# EAGLE schematic miranda_hector_115clock-6 (EAGLE 9.6.2)
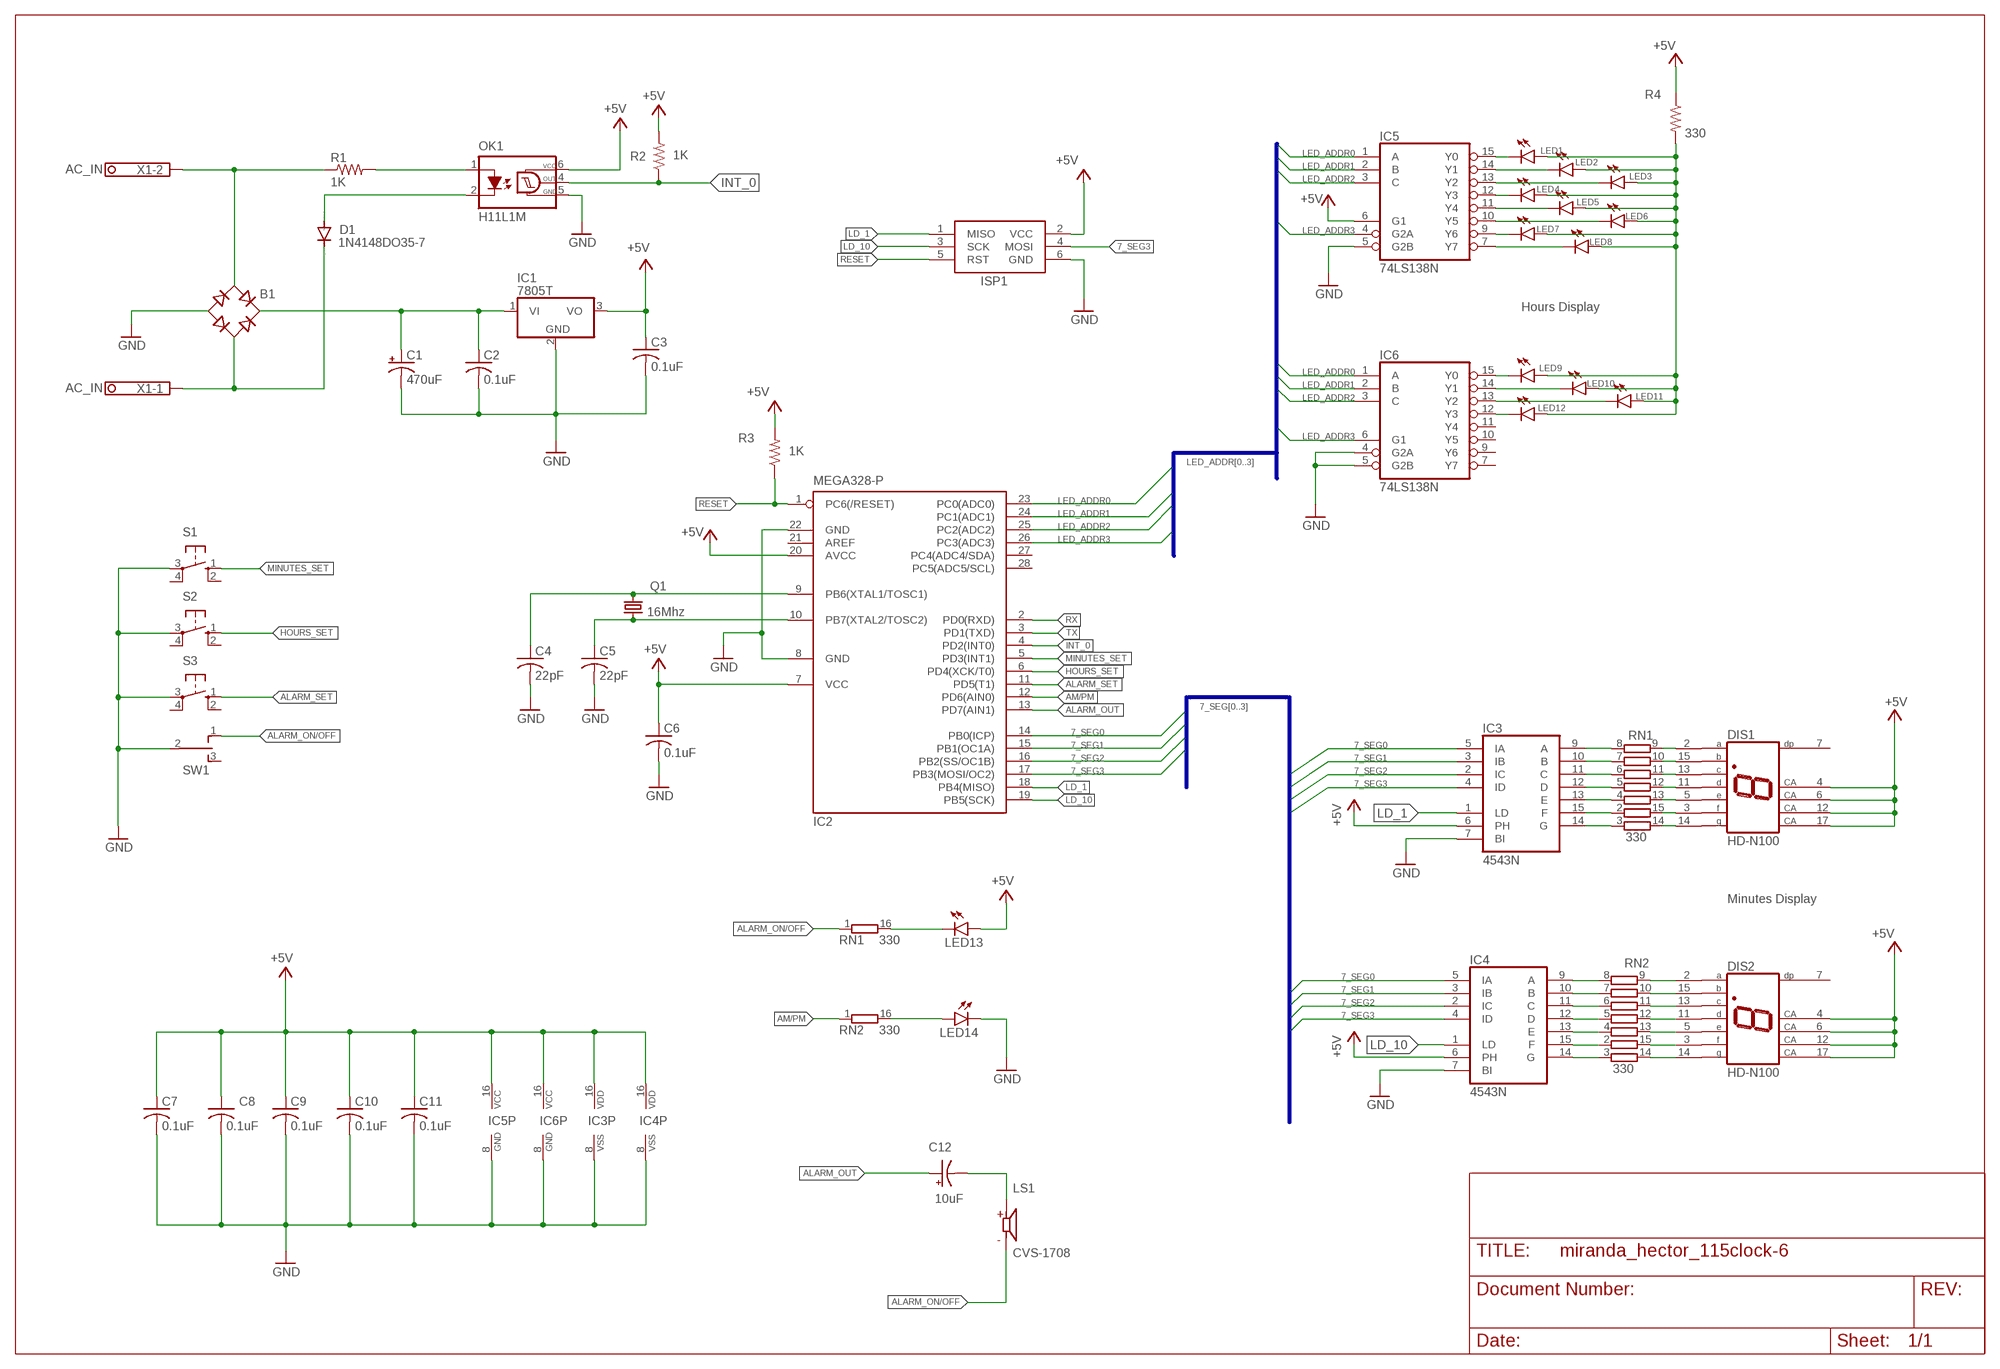
[diagram p0: schematic, sheet 1]

## Parts
B1  B-DIL  [B-DIL]
C1  470uF  CPOL-USE3.5-8  [E3,5-8]
C2  0.1uF  C-US025-025X050  [C025-025X050]
C3  0.1uF  C-US025-025X050  [C025-025X050]
C4  22pF  C-US025-025X050  [C025-025X050]
C5  22pF  C-US025-025X050  [C025-025X050]
C6  0.1uF  C-US025-025X050  [C025-025X050]
C7  0.1uF  C-US025-025X050  [C025-025X050]
C8  0.1uF  C-US025-025X050  [C025-025X050]
C9  0.1uF  C-US025-025X050  [C025-025X050]
C10  0.1uF  C-US025-025X050  [C025-025X050]
C11  0.1uF  C-US025-025X050  [C025-025X050]
C12  10uF  CPOL-USE2,5-6E  [E2,5-6E]
D1  1N4148DO35-7  [DO35-7]
DIS1  HD-N100  [HDSP-Q]
DIS2  HD-N100  [HDSP-Q]
IC1  7805T  [TO220H]
IC2  MEGA328-P  MEGA8-P  [DIL28-3]
IC3  4543N  [DIL16]
IC4  4543N  [DIL16]
IC5  74LS138N  [DIL16]
IC6  74LS138N  [DIL16]
ISP1  AVRISP-6  [AVRISP]
LED1  LED10MM  [LED10MM]
LED2  LED10MM  [LED10MM]
LED3  LED10MM  [LED10MM]
LED4  LED10MM  [LED10MM]
LED5  LED10MM  [LED10MM]
LED6  LED10MM  [LED10MM]
LED7  LED10MM  [LED10MM]
LED8  LED10MM  [LED10MM]
LED9  LED10MM  [LED10MM]
LED10  LED10MM  [LED10MM]
LED11  LED10MM  [LED10MM]
LED12  LED10MM  [LED10MM]
LED13  LED5MM  [LED5MM]
LED14  LED5MM  [LED5MM]
LS1  CVS-1708  [SPKR_CVS-1708]
OK1  H11L1M  [DIL06]
Q1  16Mhz  CRYSTALHC49S  [HC49/S]
R1  1K  R-US_0204/7  [0204/7]
R2  1K  R-US_0204/7  [0204/7]
R3  1K  R-US_0204/7  [0204/7]
R4  330  R-US_0204/7  [0204/7]
RN1  330  8R-P  [DIL16]
RN2  330  8R-P  [DIL16]
S1  10-XX  [B3F-10XX]
S2  10-XX  [B3F-10XX]
S3  10-XX  [B3F-10XX]
SW1  DIGICLOCK_S5  [FOOTPRINT_DIGICLOCK_S5]
X1  1751248  [1751248]

## Nets
7_SEG0: IC2.14(PB0(ICP)) IC3.5(IA) IC4.5(IA)
7_SEG1: IC2.15(PB1(OC1A)) IC3.3(IB) IC4.3(IB)
7_SEG2: IC2.16(PB2(SS/OC1B)) IC3.2(IC) IC4.2(IC)
7_SEG3: IC2.17(PB3(MOSI/OC2)) IC3.4(ID) IC4.4(ID) ISP1.4(MOSI)
+5V [Power]: C3.1 C6.1 C7.1 C8.1 C9.1 C10.1 C11.1 DIS1.4(CA) DIS1.6(CA) DIS1.12(CA) DIS1.17(CA) DIS2.4(CA) DIS2.6(CA) DIS2.12(CA) DIS2.17(CA) IC1.3(VO) IC2.7(VCC) IC2.20(AVCC) IC3.6(PH) IC3.16(VDD) IC4.6(PH) IC4.16(VDD) IC5.6(G1) IC5.16(VCC) IC6.16(VCC) ISP1.2(VCC) LED13.A OK1.6(VCC) R2.2 R3.2 R4.1
ALARM_ON/OFF: LS1.M RN1.1 SW1.1(O)
ALARM_OUT: C12.+ IC2.13(PD7(AIN1))
ALARM_SET: IC2.11(PD5(T1)) S3.1(S)
AM/PM: IC2.12(PD6(AIN0)) RN2.1
GND [Power]: B1.- C1.- C2.2 C3.2 C4.2 C5.2 C6.2 C7.2 C8.2 C9.2 C10.2 C11.2 IC1.2(GND) IC2.8(GND) IC2.22(GND) IC3.7(BI) IC3.8(VSS) IC4.7(BI) IC4.8(VSS) IC5.5(G2B) IC5.8(GND) IC6.4(G2A) IC6.5(G2B) IC6.8(GND) ISP1.6(GND) LED14.K(C) OK1.5(GND) S1.3(P) S2.3(P) S3.3(P) SW1.2(P)
HOURS_SET: IC2.6(PD4(XCK/T0)) S2.1(S)
INT_0: IC2.4(PD2(INT0)) OK1.4(OUT) R2.1
LD_1: IC2.18(PB4(MISO)) IC3.1(LD) ISP1.1(MISO)
LD_10: IC2.19(PB5(SCK)) IC4.1(LD) ISP1.3(SCK)
LED_ADDR0: IC2.23(PC0(ADC0)) IC5.1(A) IC6.1(A)
LED_ADDR1: IC2.24(PC1(ADC1)) IC5.2(B) IC6.2(B)
LED_ADDR2: IC2.25(PC2(ADC2)) IC5.3(C) IC6.3(C)
LED_ADDR3: IC2.26(PC3(ADC3)) IC5.4(G2A) IC6.6(G1)
MINUTES_SET: IC2.5(PD3(INT1)) S1.1(S)
N$1 [AC]: B1.AC2 D1.C X1.1
N$2 [AC]: B1.AC1 R1.1 X1.2
N$3 [AC]: OK1.1(A) R1.2
N$4 [AC]: D1.A OK1.2(C)
N$5: C4.1 IC2.9(PB6(XTAL1/TOSC1)) Q1.2
N$6: C5.1 IC2.10(PB7(XTAL2/TOSC2)) Q1.1
N$7 [Power]: B1.+ C1.+ C2.1 IC1.1(VI)
N$8: DIS1.2(A) RN1.9
N$9: DIS1.15(B) RN1.10
N$10: DIS1.13(C) RN1.11
N$11: DIS1.11(D) RN1.12
N$12: DIS1.5(E) RN1.13
N$13: DIS1.3(F) RN1.15
N$14: DIS1.14(G) RN1.14
N$15: IC3.9(A) RN1.8
N$16: IC3.10(B) RN1.7
N$17: IC3.11(C) RN1.6
N$18: IC3.12(D) RN1.5
N$19: IC3.13(E) RN1.4
N$20: IC3.15(F) RN1.2
N$21: IC3.14(G) RN1.3
N$22: DIS2.2(A) RN2.9
N$23: DIS2.15(B) RN2.10
N$24: DIS2.13(C) RN2.11
N$25: DIS2.11(D) RN2.12
N$26: DIS2.5(E) RN2.13
N$27: DIS2.3(F) RN2.15
N$28: DIS2.14(G) RN2.14
N$29: IC4.9(A) RN2.8
N$30: IC4.10(B) RN2.7
N$31: IC4.11(C) RN2.6
N$32: IC4.12(D) RN2.5
N$33: IC4.13(E) RN2.4
N$34: IC4.15(F) RN2.2
N$35: IC4.14(G) RN2.3
N$36: IC5.15(Y0) LED1.K(C)
N$37: LED1.A LED2.A LED3.A LED4.A LED5.A LED6.A LED7.A LED8.A LED9.A LED10.A LED11.A LED12.A R4.2
N$38: IC5.14(Y1) LED2.K(C)
N$39: IC5.13(Y2) LED3.K(C)
N$40: IC5.12(Y3) LED4.K(C)
N$41: IC5.11(Y4) LED5.K(C)
N$42: IC5.10(Y5) LED6.K(C)
N$43: IC5.9(Y6) LED7.K(C)
N$44: IC5.7(Y7) LED8.K(C)
N$45: IC6.15(Y0) LED9.K(C)
N$46: IC6.14(Y1) LED10.K(C)
N$47: IC6.13(Y2) LED11.K(C)
N$48: IC6.12(Y3) LED12.K(C)
N$50: LED13.K(C) RN1.16
N$51: LED14.A RN2.16
N$52: C12.- LS1.P
RESET: IC2.1(PC6(/RESET)) ISP1.5(RST) R3.1
RX: IC2.2(PD0(RXD))
TX: IC2.3(PD1(TXD))
Unconnected: DIS1.7(DP) DIS2.7(DP) IC2.21(AREF) IC2.27(PC4(ADC4/SDA)) IC2.28(PC5(ADC5/SCL)) IC6.7(Y7) IC6.9(Y6) IC6.10(Y5) IC6.11(Y4) S1.2(S1) S1.4(P1) S2.2(S1) S2.4(P1) S3.2(S1) S3.4(P1) SW1.3(S)

## Buses
LED_ADDR[0..3]
7_SEG[0..3]

## Notes on the sheet
- AC_IN
- Hours Display
- AC_IN
- RN1
- Minutes Display
- RN2

## Library data of the parts
B1 = rectifier:B-DIL: RECTIFIER
C1 C12 = rcl:CPOL-US: POLARIZED CAPACITOR, American symbol; SPICEPREFIX: C
C2-C11 = rcl:C-US: CAPACITOR, American symbol; SPICEPREFIX: C
D1 = diode:1N4148: DIODE high speed (Philips)
DIS1 DIS2 = display-hp:HD-N100: LED DISPLAY 1-character 7 segment, decimal point left; OC_FARNELL: unknown; OC_NEWARK: unknown
IC1 = linear:78*: Positive VOLTAGE REGULATOR Source: http://cache.national.com/ds/LM/LM78L05.pdf http://www.fairchildsemi.com/ds/LM/LM7805.pdf
IC2 = atmel:MEGA8-P: MICROCONTROLLER 8 Kbytes FLASH, 1 kbytes SRAM, 512 bytes EEPROM, USART, 4-channel 10 bit ADC, 2-channel 8 bit ADC Pin compatible with Atmega48, ATMega88, ATMega168 Source: avr.lbr; OC_FARNELL: unknown; OC_NEWARK: unknown
IC3 IC4 = 45xx:4543: BCD to 7-segment LCD DECODER
IC5 IC6 = 74xx-eu:74*138: 3-line to 8-line DECODER/DEMULTIPLEXER
ISP1 = adafruit:AVRISP: AVR ISP HEADER Standard 6 pin header for AVR programming
LED1-LED14 = led:LED: LED OSRAM: - CHIPLED LG R971, LG N971, LY N971, LG Q971, LY Q971, LO R971, LY R971 LH N974, LH R974 LS Q976, LO Q976, LY Q976 LO Q996 - Hyper CHIPLED LW Q18S LB Q993, LB Q99A, LB R99A - SideLED LS A670, LO A670, LY A670, LG A670, LP A670 LB A673, LV A673, LT A673, LW A673 LH A674 LY A675 LS A676, LA A676, LO A676, LY A676, LW A676 LS A679, LY A679, LG A679 - Hyper Micro SIDELED® LS Y876, LA Y876, LO Y876, LY Y876 LT Y87S - SmartLED LW L88C, LW L88S LB L89C, LB L89S, LG L890 LS L89K, LO L89K, LY L89K LS L896, LA L896, LO L896, LY L896 - TOPLED LS T670, LO T670, LY T670, LG T670, LP T670 LSG T670, LSP T670, LSY T670, LOP T670, LYG T670 LG T671, LOG T671, LSG T671 LB T673, LV T673, LT T673, LW T673 LH T674 LS T676, LA T676, LO T676, LY T676, LB T676, LH T676, LSB T676, LW T676 LB T67C, LV T67C, LT T67C, LS T67K, LO T67K, LY T67K, LW E67C LS E67B, LA E67B, LO E67B, LY E67B, LB E67C, LV E67C, LT E67C LW T67C LS T679, LY T679, LG T679 LS T770, LO T770, LY T770, LG T770, LP T770 LB T773, LV T773, LT T773, LW T773 LH T774 LS E675, LA E675, LY E675, LS T675 LS T776, LA T776, LO T776, LY T776, LB T776 LHGB T686 LT T68C, LB T68C - Hyper Mini TOPLED® LB M676 - Mini TOPLED Santana® LG M470 LS M47K, LO M47K, LY M47K Source: http://www.osram.convergy.de LUXEON: - LUMILED® LXK2-PW12-R00, LXK2-PW12-S00, LXK2-PW14-U00, LXK2-PW14-V00 LXK2-PM12-R00, LXK2-PM12-S00, LXK2-PM14-U00 LXK2-PE12-Q00, LXK2-PE12-R00, LXK2-PE12-S00, LXK2-PE14-T00, LXK2-PE14-U00 LXK2-PB12-K00, LXK2-PB12-L00, LXK2-PB12-M00, LXK2-PB14-N00, LXK2-PB14-P00, LXK2-PB14-Q00 LXK2-PR12-L00, LXK2-PR12-M00, LXK2-PR14-Q00, LXK2-PR14-R00 LXK2-PD12-Q00, LXK2-PD12-R00, LXK2-PD12-S00 LXK2-PH12-R00, LXK2-PH12-S00 LXK2-PL12-P00, LXK2-PL12-Q00, LXK2-PL12-R00 Source: www.luxeon.com KINGBRIGHT: KA-3528ASYC Source: www.kingbright.com
LS1 = CVS-1708:CVS-1708: CLS Series 8 Ohm 1500 Hz 87 dB 0.2 W Ø 17 x 8 mm Magnetic Speaker; AVAILABILITY: Good; DESCRIPTION: CLS Series 8 Ohm 1500 Hz 87 dB 0.2 W Ø 17 x 8 mm Magnetic Speaker; MF: CUI; MP: CVS-1708; PACKAGE: CUI; PRICE: 2.13 USD
OK1 = optocoupler:H11L*M: 6-Pin DIP Optocoupler Source: http://www.fairchildsemi.com/ds/H1/H11L2-M.pdf; MF: FAIRCHILD SEMICONDUCTOR; MPN: H11L1-M; OC_FARNELL: 1021127; OC_NEWARK: 72K8643
Q1 = crystal:CRYSTAL: CRYSTAL; OC_FARNELL: 1667008; OC_NEWARK: unknown
R1-R4 = rcl:R-US_: RESISTOR, American symbol; SPICEPREFIX: R
RN1 RN2 = resistor-dil:8R-P: DIL RESISTOR; OC_FARNELL: unknown; OC_NEWARK: unknown
S1-S3 = switch-omron:10-XX: OMRON SWITCH; MPN: B3F-1000; OC_FARNELL: 176432; OC_NEWARK: 36M3542
SW1 = Digiclock_S5:DIGICLOCK_S5
X1 = con-phoenix-350:1751248: MKDS 1/ 2-3,5 Printklemme Nennstrom: 10 A Bemessungsspannung: 160 V Raster: 3,5 mm Polzahl: 2 Montageart: Löten Anschlussart: Schraubanschluss Anschlussrichtung vom Leiter zur Platine: 0° Source: http://eshop.phoenixcontact.com .. 1751248.pdf; OC_FARNELL: unknown; OC_NEWARK: unknown

## Net classes
0 default: width 0.203 mm, clearance 0.203 mm
1 AC: width 0.305 mm, clearance 0.762 mm
2 Power: width 0.305 mm, clearance 0.305 mm